# Altium project ATRACK_WIFI_V1.PrjPCB
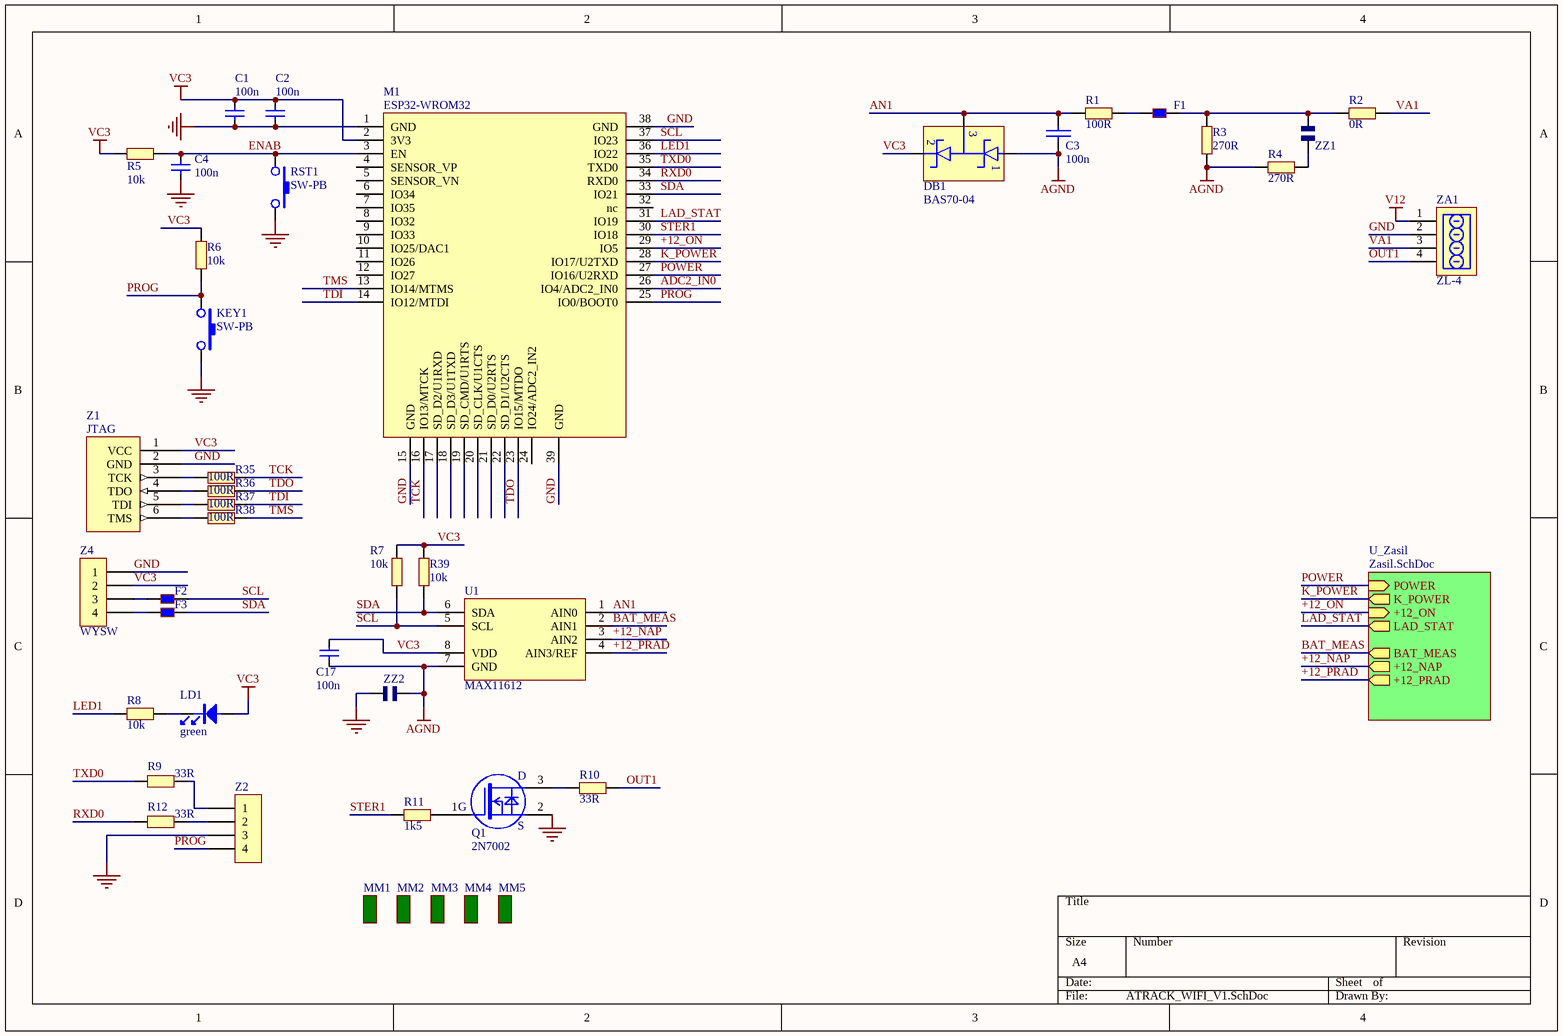
[diagram p0: ATRACK_WIFI_V1.SchDoc]
2 sheets, 89 parts. Net scope: hierarchical (ports join the sheet entries above them; power ports are global).
Board file: ATRACK_WIFI_V1.PcbDoc
Sheets:
  ATRACK_WIFI_V1.SchDoc
    U_Zasil = Zasil.SchDoc

## Sheet ATRACK_WIFI_V1.SchDoc
size A4

### Parts
C1  100n  [0603C]
C2  100n  [0603C]
C3  100n  [0603C]
C4  100n  [0603C]
C17  100n  [0603C]
DB1  BAS70-04  [SOT-23]
F1  (no value)  [0603L]
F2  BLM18BB141SN1D  [0603R]  (value not drawn)
F3  BLM18BB141SN1D  [0603R]  (value not drawn)
KEY1  SW-PB  [DTSM31N_2]
LD1  green  [0603D]
M1  ESP32-WROM32  [ESP32-WROM32]
MM1  (no value)  [REF_CIR]
MM2  (no value)  [REF_CIR]
MM3  (no value)  [REF_SQR]
MM4  (no value)  [REF_SQR]
MM5  (no value)  [PB_FREE_GRAF]
Q1  2N7002  [SOT23]
R1  100R  [0603R]
R2  0R  [0603R]
R3  270R  [0603R]
R4  270R  [0603R]
R5  10k  [0603R]
R6  10k  [0603R]
R7  10k  [0603R]
R8  10k  [0603R]
R9  33R  [0603R]
R10  33R  [0603R]
R11  1k5  [0603R]
R12  33R  [0603R]
R35  100R  [0603R]
R36  100R  [0603R]
R37  100R  [0603R]
R38  100R  [0603R]
R39  10k  [0603R]
RST1  SW-PB  [DTSM31N_2]
U1  MAX11612  [uMAX8]
Z1  JTAG  [PIN6]
Z2  (no value)  [PIN4]
Z4  WYSW  [UMATCH-4]
ZA1  ZL-4  [PIN4_2.5]
ZZ1  (no value)  [ZW1]
ZZ2  (no value)  [ZW1]

### Sub-sheets
U_Zasil = Zasil.SchDoc: LAD_STAT (out), POWER (in), K_POWER (out), BAT_MEAS (out), +12_ON (in), +12_NAP (out), +12_PRAD (out)

### Nets
AGND: C3.2 C17.2 DB1.1 R3.1 R4.2 U1.7(GND) ZZ2.1
GND: C1.1 C2.1 C4.2 KEY1.2 M1.1(GND) M1.15(GND) M1.38(GND) M1.39(GND) Q1.2(S) RST1.2 Z1.2(GND) Z2.3 Z4.1 ZA1.2 ZZ2.2
V12: ZA1.1
VC3: C1.2 C2.2 C17.1 DB1.2 LD1.A M1.2(3V3) R5.2 R6.2 R7.2 R39.2 U1.8(VDD) Z1.1(VCC) Z4.2
+12_NAP: U1.3(AIN2) ; sheet U_Zasil/+12_NAP
+12_ON: M1.29(IO5) ; sheet U_Zasil/+12_ON
+12_PRAD: U1.4(AIN3/REF) ; sheet U_Zasil/+12_PRAD
ADC2_IN0: M1.26(IO4/ADC2_IN0)
AN1: C3.1 DB1.3 R1.2 U1.1(AIN0)
BAT_MEAS: U1.2(AIN1) ; sheet U_Zasil/BAT_MEAS
ENAB: C4.1 M1.3(EN) R5.1 RST1.1
K_POWER: M1.28(IO17/U2TXD) ; sheet U_Zasil/K_POWER
LAD_STAT: M1.31(IO19) ; sheet U_Zasil/LAD_STAT
LED1: M1.36(IO22) R8.1
OUT1: R10.2 ZA1.4
POWER: M1.27(IO16/U2RXD) ; sheet U_Zasil/POWER
PROG: KEY1.1 M1.25(IO0/BOOT0) R6.1 Z2.4
RXD0: M1.34(RXD0) R12.2
SCL: F2.2 M1.37(IO23) R7.1 U1.5(SCL)
SDA: F3.2 M1.33(IO21) R39.1 U1.6(SDA)
STER1: M1.30(IO18) R11.1
TCK: M1.16(IO13/MTCK) R35.1
TDI: M1.14(IO12/MTDI) R37.1
TDO: M1.23(IO15/MTDO) R36.1
TMS: M1.13(IO14/MTMS) R38.1
TXD0: M1.35(TXD0) R9.2
VA1: R2.1 ZA1.3
NetF1_1: F1.1 R1.1
NetF1_2: F1.2 R2.2 R3.2 ZZ1.2
NetF2_1: F2.1 Z4.3
NetF3_1: F3.1 Z4.4
NetLD1_K: LD1.K R8.2
NetQ1_1: Q1.1 R11.2
NetQ1_3: Q1.3(D) R10.1
NetR4_1: R4.1 ZZ1.1
NetR9_1: R9.1 Z2.1
NetR12_1: R12.1 Z2.2
NetR35_2: R35.2 Z1.3(TCK)
NetR36_2: R36.2 Z1.4(TDO)
NetR37_2: R37.2 Z1.5(TDI)
NetR38_2: R38.2 Z1.6(TMS)

Not connected (* = marked no-connect by the designer): M1 4(SENSOR_VP) 5(SENSOR_VN) 6(IO34) 7(IO35) 8(IO32) 9(IO33) 10(IO25/DAC1) 11(IO26) 12(IO27) 17(SD_D2/U1RXD) 18(SD_D3/U1TXD) 19(SD_CMD/U1RTS) 20(SD_CLK/U1CTS) 21(SD_D0/U2RTS) 22(SD_D1/U2CTS) 24(IO24/ADC2_IN2) 32(nc)

### Notes on the sheet
- (in symbol MOSFET-P_1_1) G

### Library data of the parts
C1 C2 C4 C17 = CAP
C3 = CAP: Capacitor
F1-F3 = KORALIK: Koralik ferrytowy
LD1 = LED: Manuf_1: everlight; Manuf_Part_1: 19-213-R6C-AP1Q2B/3T; Description: LED,red,0603,19-213-R6C-AP1Q2B/3T,everlight; ECCN_US/EU: EAR99/NEC; Order: 19-213-R6C-AP1Q2B/3T
MM1-MM5 = MECH
Q1 = MOSFET-P_1_1
R1-R12 R35-R39 = RES3
Z1 = Pro1F9.tmp_JTAG_64
Z2 Z4 = CON4: Connector
ZZ1 ZZ2 = ZWORA

## Sheet Zasil.SchDoc
size A4
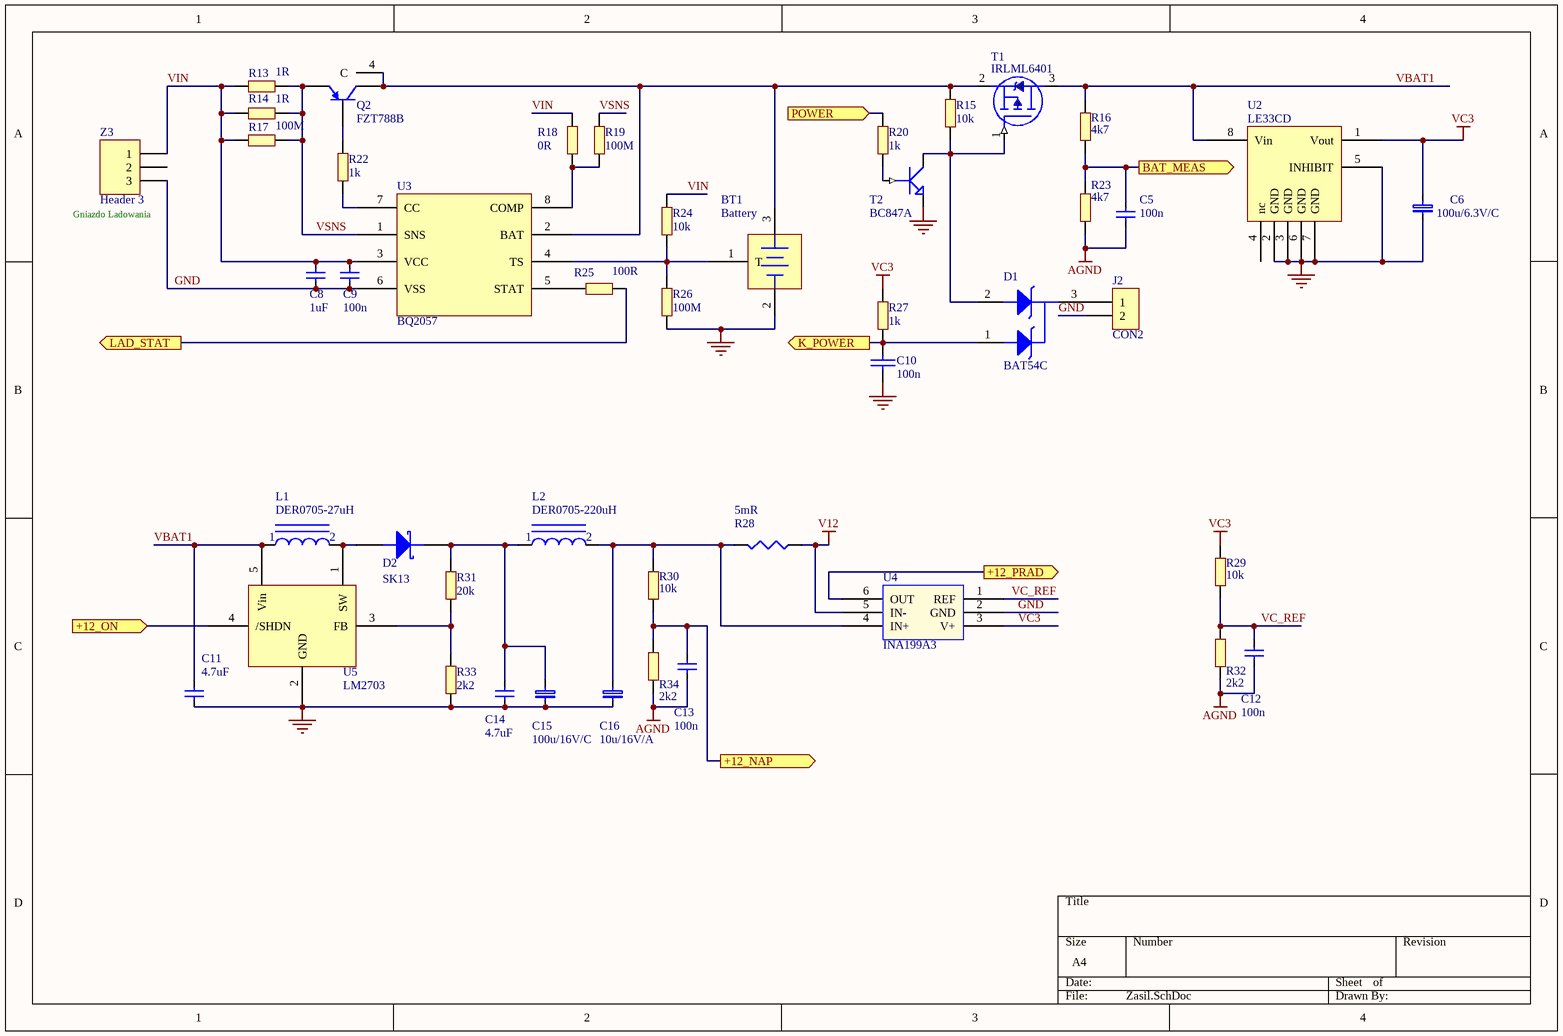
[diagram p1: Zasil.SchDoc]

### Parts
BT1  Battery  [BAT4]
C5  100n  [0603C]
C6  100u/6.3V/C  [CAP_C]
C8  1uF  [0603C]
C9  100n  [0603C]
C10  100n  [0603C]
C11  4.7uF  [1206]
C12  100n  [0603C]
C13  100n  [0603C]
C14  4.7uF  [1206]
C15  100u/16V/C  [CAP_C]
C16  10u/16V/A  [CAP_A]
D1  BAT54C  [SOT23]
D2  SK13  [RD5]
J2  CON2  [SIP2]
L1  DER0705-27uH  [DER0705]
L2  DER0705-220uH  [DER0705]
Q2  FZT788B  [MP04A_N1]
R13  1R  [0805R]
R14  1R  [0805R]
R15  10k  [0603R]
R16  4k7  [0603R]
R17  100M  [0805R]
R18  0R  [0603R]
R19  100M  [0603R]
R20  1k  [0603R]
R22  1k  [0603R]
R23  4k7  [0603R]
R24  10k  [0603R]
R25  100R  [0603R]
R26  100M  [0603R]
R27  1k  [0603R]
R28  5mR  [1206R]
R29  10k  [0603R]
R30  10k  [0603R]
R31  20k  [0603R]
R32  2k2  [0603R]
R33  2k2  [0603R]
R34  2k2  [0603R]
T1  IRLML6401  [SOT23]
T2  BC847A  [SOT23]
U2  LE33CD  [SO8]
U3  BQ2057  [SO8]
U4  INA199A3  [SC70-6]
U5  LM2703  [SOT23-5]
Z3  Header 3  [PIN3_2.5]

### Ports
+12_NAP (out), +12_ON (in), +12_PRAD (out), BAT_MEAS (out), K_POWER (out), LAD_STAT (out), POWER (in)

### Nets
AGND: C5.2 C12.2 C13.2 R23.1 R32.1 R34.1
GND: BT1.2(-) C6.1 C8.2 C9.2 C10.2 C11.2 C14.2 C15.1 C16.1 J2.2 R26.2 R33.2 T2.2(E) U2.2(GND) U2.3(GND) U2.5(INHIBIT) U2.6(GND) U2.7(GND) U3.6(VSS) U4.2(GND) U5.2(GND) Z3.3
V12: R28.1 U4.5(IN-)
VC3: C6.2 R27.2 R29.2 U2.1(Vout) U4.3(V+)
+12_NAP: C13.1 R30.1 R34.2 ; port +12_NAP
+12_ON: U5.4(/SHDN) ; port +12_ON
+12_PRAD: U4.6(OUT) ; port +12_PRAD
BAT_MEAS: C5.1 R16.1 R23.2 ; port BAT_MEAS
K_POWER: C10.1 D1.1(A1) R27.1 ; port K_POWER
LAD_STAT: R25.2 ; port LAD_STAT
POWER: R20.2 ; port POWER
VBAT1: C11.1 L1.1 R16.2 T1.3(DRAIN) U2.8(Vin) U5.5(Vin)
VC_REF: C12.1 R29.1 R32.2 U4.1(REF)
VIN: C8.1 C9.1 R13.1 R14.1 R17.1 R18.1 R24.1 U3.3(VCC) Z3.1
VSNS: Q2.3(E) R13.2 R14.2 R17.2 R19.1 U3.1(SNS)
NetBT1_1: BT1.1(T) R24.2 R26.1 U3.4(TS)
NetBT1_3: BT1.3(+) Q2.2(C) Q2.4(C) R15.2 T1.2(SOURCE) U3.2(BAT)
NetC14_1: C14.1 C15.2 D2.K L2.1 R31.1
NetC16_2: C16.2 L2.2 R28.2 R30.2 U4.4(IN+)
NetD1_2: D1.2(A2) R15.1 T1.1(GATE) T2.3(C)
NetD1_3: D1.3(K) J2.1
NetD2_A: D2.A L1.2 U5.1(SW)
NetQ2_1: Q2.1(B) R22.1
NetR18_2: R18.2 R19.2 U3.8(COMP)
NetR20_1: R20.1 T2.1(B)
NetR22_2: R22.2 U3.7(CC)
NetR25_1: R25.1 U3.5(STAT)
NetR31_2: R31.2 R33.1 U5.3(FB)

Not connected (* = marked no-connect by the designer): U2 4(nc); Z3 2

### Notes on the sheet
- (near Z3) Gniazdo Ladowania

### Library data of the parts
BT1 = BAT_TEL: Multicell Battery; Published: *; LatestRevisionDate: *; LatestRevisionNote: *; PackageReference: *; Publisher: *
C5 C8 C9 C11-C14 = CAP
C6 C15 C16 = CAP_TANTAL_SMD: KONDENSATOR ELEKTROLITYCZNY TANTALOWY SMD
C10 = CAP: Capacitor
D2 = DIODE SCHOTTKY: Schottky Diode
J2 = CON2: Connector
L1 L2 = CEWKA_1
Q2 = PNP: Published: 8-Jun-2000; LatestRevisionDate: 29-May-2009; LatestRevisionNote: IPC-7351 Footprint Added.; PackageVersion: Aug-1999; PackageReference: SOT-23B; Publisher: Altium Limited; PackageDescription: 3-Pin SOT-23 Package 0.95 mm Pitch, 2.4 mm Lead Span
R13-R20 R22-R27 R29-R34 = RES3
R28 = RES1: Dostawca.Symbol: WW12RR005FTL; Dostawca: TME
T1 = IRLML9303: Low Charge N-Channel MOSFET
T2 = BC847A: NPN Transistor
U2 = LE33
U4 = INA199: Dostawca.Symbol: INA199A3DCKT; Dostawca: TME
Z3 = Header 3: Header, 3-Pin; LatestRevisionDate: 17-Jul-2002; LatestRevisionNote: Re-released for DXP Platform.; Publisher: Altium Limited

## Nets that join several sheets
AGND: ATRACK_WIFI_V1 (7 pins), Zasil (6 pins)
GND: ATRACK_WIFI_V1 (15 pins), Zasil (22 pins)
V12: ATRACK_WIFI_V1 (ZA1.1), Zasil (R28.1 U4.5)
VC3: ATRACK_WIFI_V1 (13 pins), Zasil (5 pins)
+12_NAP: ATRACK_WIFI_V1 (U1.3), Zasil (C13.1 R30.1 R34.2)
+12_ON: ATRACK_WIFI_V1 (M1.29), Zasil (U5.4)
+12_PRAD: ATRACK_WIFI_V1 (U1.4), Zasil (U4.6)
BAT_MEAS: ATRACK_WIFI_V1 (U1.2), Zasil (C5.1 R16.1 R23.2)
K_POWER: ATRACK_WIFI_V1 (M1.28), Zasil (C10.1 D1.1 R27.1)
LAD_STAT: ATRACK_WIFI_V1 (M1.31), Zasil (R25.2)
POWER: ATRACK_WIFI_V1 (M1.27), Zasil (R20.2)